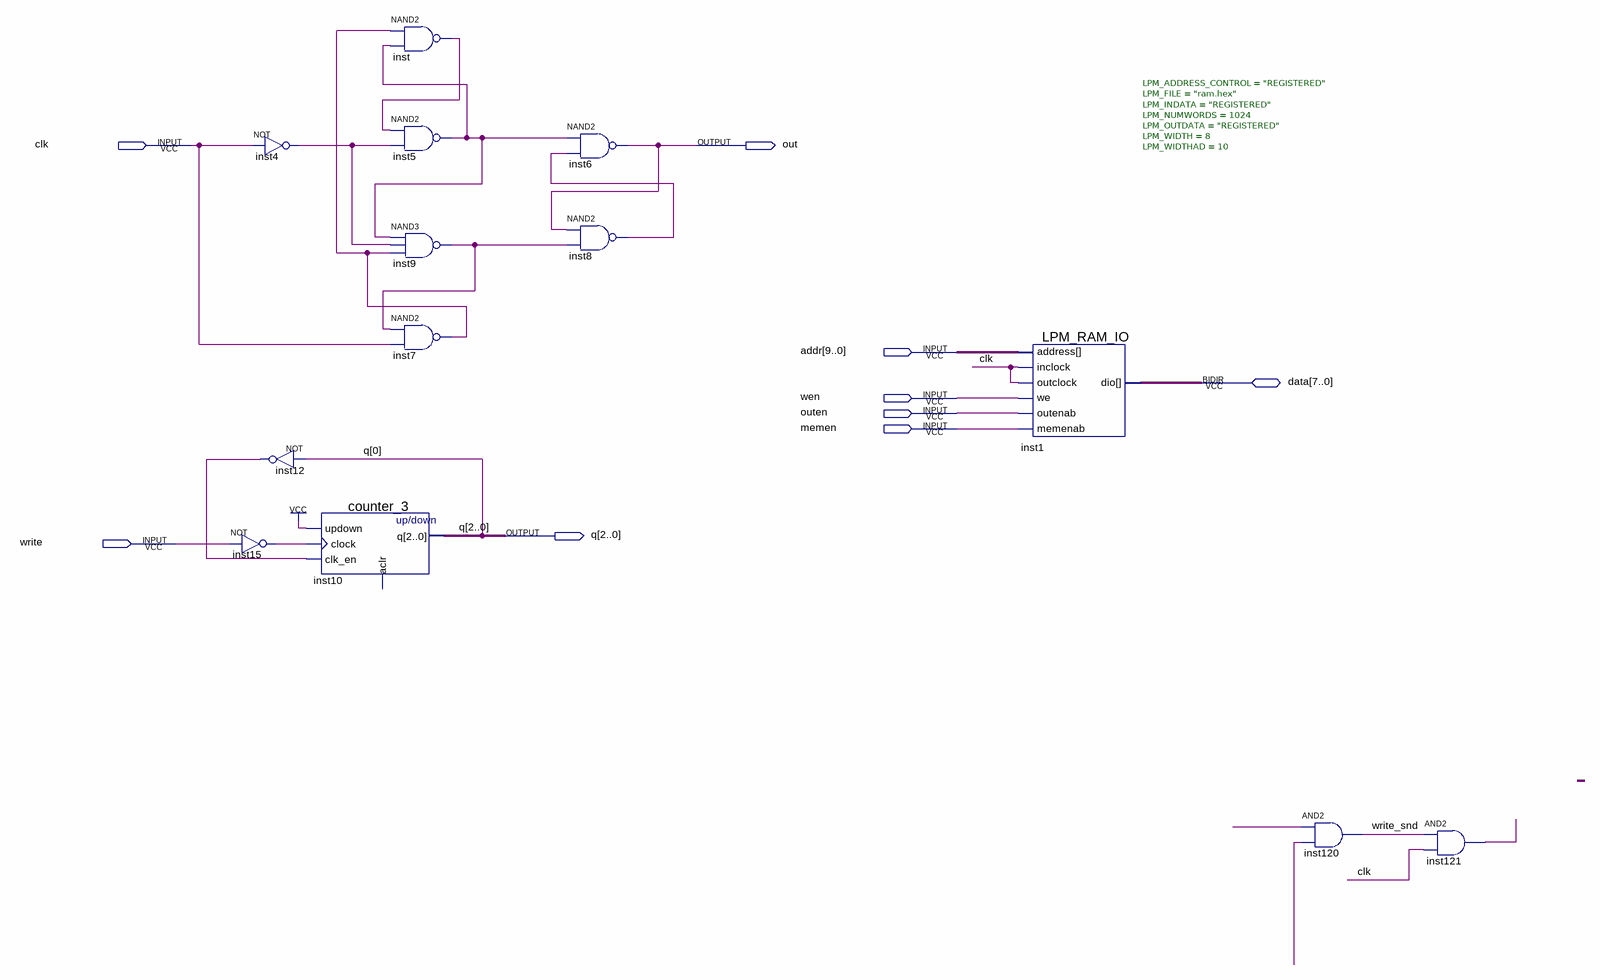
[diagram p0: schematic sheet]
// Quartus schematic __test.bdf as structural Verilog: 13 symbols, 9 pins
module __test (
  input  clk,
  input  [9:0] addr,
  input  wen,
  input  outen,
  input  memen,
  input  write,
  inout  [7:0] data,
  output out,
  output [2:0] q
);

  wire inst4_out, inst5_out, inst7_out, inst8_out, inst9_out, inst12_out, inst15_out, inst121_out, inst_out,
       undriven, undriven_2, write_snd;

  not inst15 (inst15_out, write);
  not inst4 (inst4_out, clk);
  not inst12 (inst12_out, q[0]);
  counter_3 inst10 (.updown(1'b1), .clock(inst15_out), .clk_en(inst12_out), .q(q));  // open: aclr
  nand inst (inst_out, inst7_out, inst5_out);
  nand inst5 (inst5_out, inst_out, inst4_out);
  nand inst9 (inst9_out, inst5_out, inst4_out, inst7_out);
  nand inst7 (inst7_out, inst9_out, clk);
  nand inst6 (out, inst5_out, inst8_out);
  nand inst8 (inst8_out, out, inst9_out);
  LPM_RAM_IO #(.LPM_ADDRESS_CONTROL("REGISTERED"), .LPM_FILE("ram.hex"), .LPM_INDATA("REGISTERED"), .LPM_NUMWORDS(1024), .LPM_OUTDATA("REGISTERED"), .LPM_WIDTH(8), .LPM_WIDTHAD(10)) inst1 (
    .address(addr), .outclock(clk), .memenab(memen), .inclock(clk), .we(wen), .outenab(outen), .dio(data));
  and inst120 (write_snd, undriven_2, undriven);
  and inst121 (inst121_out, write_snd, clk);
endmodule
